# Altium schematic sheet relayOut.SchDoc
size A4
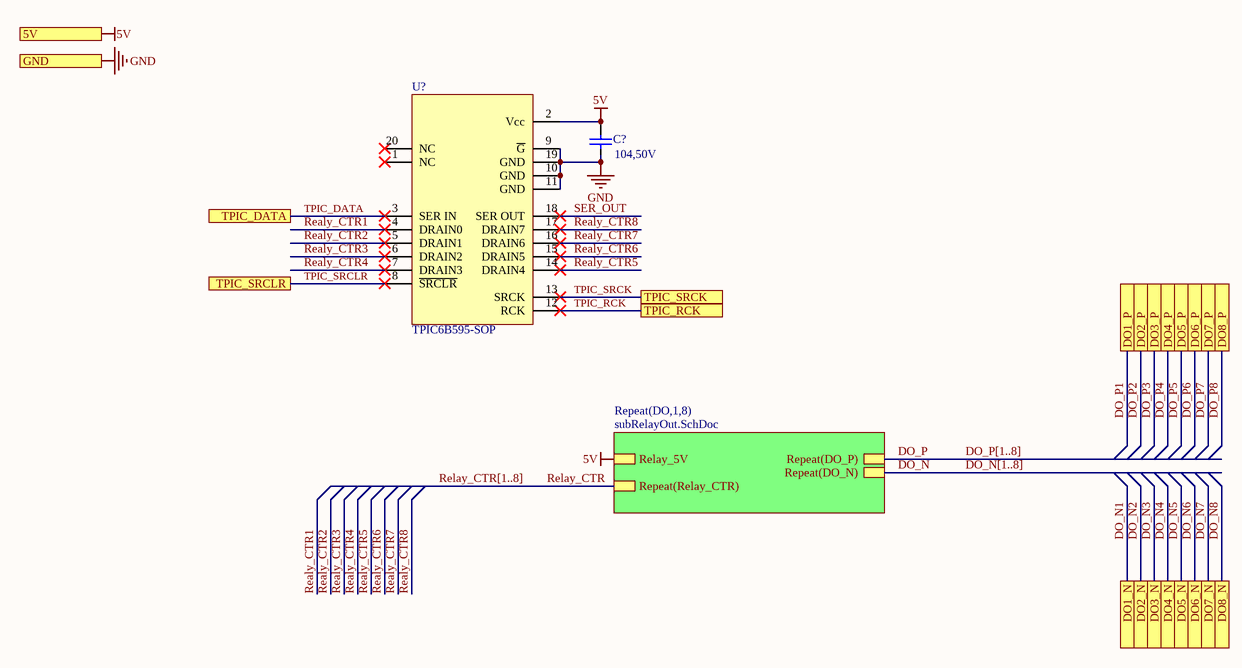
[diagram p0: relayOut.SchDoc]

## Parts
C?  104,50V  [C0805 - 1]
U?  TPIC6B595-SOP  [TPIC6B595]

## Sub-sheets
Repeat(DO,1,8) = subRelayOut.SchDoc: Repeat(DO_P), Repeat(DO_N), Relay_5V, Repeat(Relay_CTR)

## Ports
5V, DO1_N, DO1_P, DO2_N, DO2_P, DO3_N, DO3_P, DO4_N, DO4_P, DO5_N, DO5_P, DO6_N, DO6_P, DO7_N, DO7_P, DO8_N, DO8_P, GND, TPIC_DATA, TPIC_RCK, TPIC_SRCK, TPIC_SRCLR

## Nets
5V: C?.2 U?.2(Vcc) ; port 5V, sheet Repeat(DO,1,8)/Relay_5V
GND: C?.1 U?.9(~{G}) U?.10(GND) U?.11(GND) U?.19(GND) ; port GND
DO_N: sheet Repeat(DO,1,8)/Repeat(DO_N)
DO_N1: port DO1_N
DO_N2: port DO2_N
DO_N3: port DO3_N
DO_N4: port DO4_N
DO_N5: port DO5_N
DO_N6: port DO6_N
DO_N7: port DO7_N
DO_N8: port DO8_N
DO_P: sheet Repeat(DO,1,8)/Repeat(DO_P)
DO_P1: port DO1_P
DO_P2: port DO2_P
DO_P3: port DO3_P
DO_P4: port DO4_P
DO_P5: port DO5_P
DO_P6: port DO6_P
DO_P7: port DO7_P
DO_P8: port DO8_P
Realy_CTR1: U?.4(DRAIN0)
Realy_CTR2: U?.5(DRAIN1)
Realy_CTR3: U?.6(DRAIN2)
Realy_CTR4: U?.7(DRAIN3)
Realy_CTR5: U?.14(DRAIN4)
Realy_CTR6: U?.15(DRAIN5)
Realy_CTR7: U?.16(DRAIN6)
Realy_CTR8: U?.17(DRAIN7)
Relay_CTR: sheet Repeat(DO,1,8)/Repeat(Relay_CTR)
SER_OUT: U?.18(SER_OUT)
TPIC_DATA: U?.3(SER_IN) ; port TPIC_DATA
TPIC_RCK: U?.12(RCK) ; port TPIC_RCK
TPIC_SRCK: U?.13(SRCK) ; port TPIC_SRCK
TPIC_SRCLR: U?.8(~{SRCLR}) ; port TPIC_SRCLR

Not connected (* = marked no-connect by the designer): U? 1(NC)* 20(NC)*

## Buses and harness runs
bus DO_N[1..8]
bus DO_P[1..8]
bus Relay_CTR[1..8]

## Library data of the parts
C? = 无极电容: Value: 104, 16V; Type: 贴片电容
U? = TPIC6B595: name: 集成模块（SMD）